# Altium schematic sheet L298.SchDoc
size A4
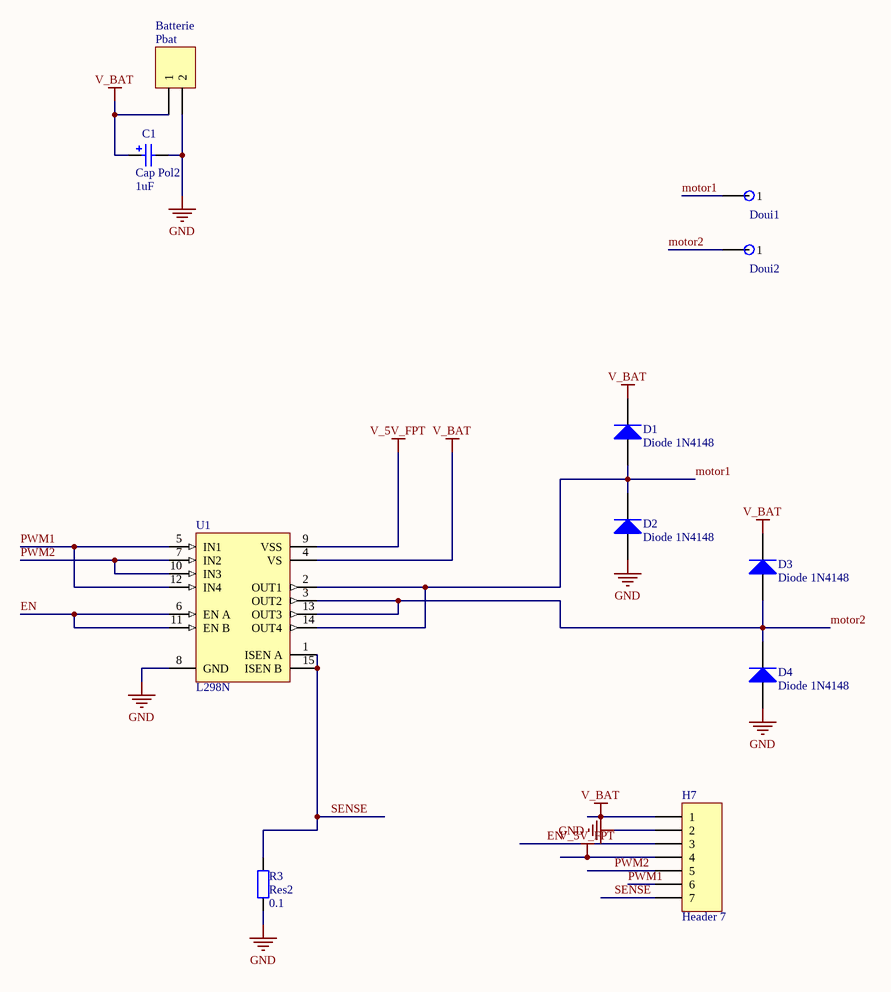
[diagram p0: L298.SchDoc]

## Parts
C1  Cap Pol2  value 1uF  [Capa2_pol]
D1  Diode 1N4148  [Ddiode]
D2  Diode 1N4148  [Ddiode]
D3  Diode 1N4148  [Ddiode]
D4  Diode 1N4148  [Ddiode]
Doui1  douille_2mm  [Douille-2mm]  (value not drawn)
Doui2  douille_2mm  [Douille-2mm]  (value not drawn)
H7  Header 7  [HDR1X7]
Pbat  Batterie  [Bornier_2]
R3  Res2  value 0.1  [res5_1/4W]
U1  L298N  [Multiwatt15V]

## Nets
GND: C1.2 D2.1(A) D4.1(A) H7.2 Pbat.2 R3.2 U1.8(GND)
V_5V_FPT: H7.4 U1.9(VSS)
V_BAT: C1.1 D1.2(K) D3.2(K) H7.1 Pbat.1 U1.4(VS)
EN: H7.3 U1.6(EN_A) U1.11(EN_B)
motor1: D1.1(A) D2.2(K) Doui1.1 U1.2(OUT1) U1.14(OUT4)
motor2: D3.1(A) D4.2(K) Doui2.1 U1.3(OUT2) U1.13(OUT3)
PWM1: H7.6 U1.5(IN1) U1.12(IN4)
PWM2: H7.5 U1.7(IN2) U1.10(IN3)
SENSE: H7.7 R3.1 U1.1(ISEN_A) U1.15(ISEN_B)

## Library data of the parts
C1 = Cap Pol2: Polarized Capacitor (Radial); Published: 8-Jun-2000; LatestRevisionDate: 17-Jul-2002; LatestRevisionNote: Re-released for DXP Platform.; PackageReference: RB7.6-15; Publisher: Altium Limited
D1-D4 = Diode 1N4148: High Conductance Fast Diode; pin to pad: 1>A 2>K; Published: 8-Jun-2000; LatestRevisionDate: 17-Jul-2002; LatestRevisionNote: Re-released for DXP Platform.; DatasheetDocument: 1997; PackageReference: DO-35; Publisher: Altium Limited; Code_JEDEC: DO-204-AH; ComponentLink1Description: Manufacturer Link; ComponentLink1URL: http://www.fairchildsemi.com/; ComponentLink2Description: Datasheet; ComponentLink2URL: http://www.fairchildsemi.com/ds/1N%2F1N4148.pdf
Doui1 Doui2 = douille_2mm: 1-Pin; LatestRevisionDate: 17-Jul-2002; LatestRevisionNote: Re-released for DXP Platform.; Publisher: Altium Limited
H7 = Header 7: Header, 7-Pin; LatestRevisionDate: 17-Jul-2002; LatestRevisionNote: Re-released for DXP Platform.; Publisher: Altium Limited
Pbat = Bornier_2: Header, 2-Pin; LatestRevisionDate: 17-Jul-2002; LatestRevisionNote: Re-released for DXP Platform.; Publisher: Altium Limited
R3 = Res2: Resistor; Published: 8-Jun-2000; LatestRevisionDate: 17-Jul-2002; LatestRevisionNote: Re-released for DXP Platform.; PackageReference: AXIAL-0.4; Publisher: Altium Limited
U1 = L298N: Dual Full Bridge Driver; Published: 8-Jun-2000; LatestRevisionDate: 14-May-2007; LatestRevisionNote: Mapped to vertical PCB.; DatasheetVersion: Jul-1999; PackageReference: Multiwatt15V; Publisher: Altium Limited; PackageDescription: TO, Thru-Hole, Vertical, Heatsink Mounted; 15 Bent Staggered Leads; Pitch 1.27 mm; ComponentLink1Description: Manufacturer Link; ComponentLink1URL: http://www.st.com/; ComponentLink2Description: Datasheet; ComponentLink2URL: http://www.st.com/stonline/products/literature/ds/1773/l298.pdf